# EAGLE design bpf+att (EAGLE 9.6.2)
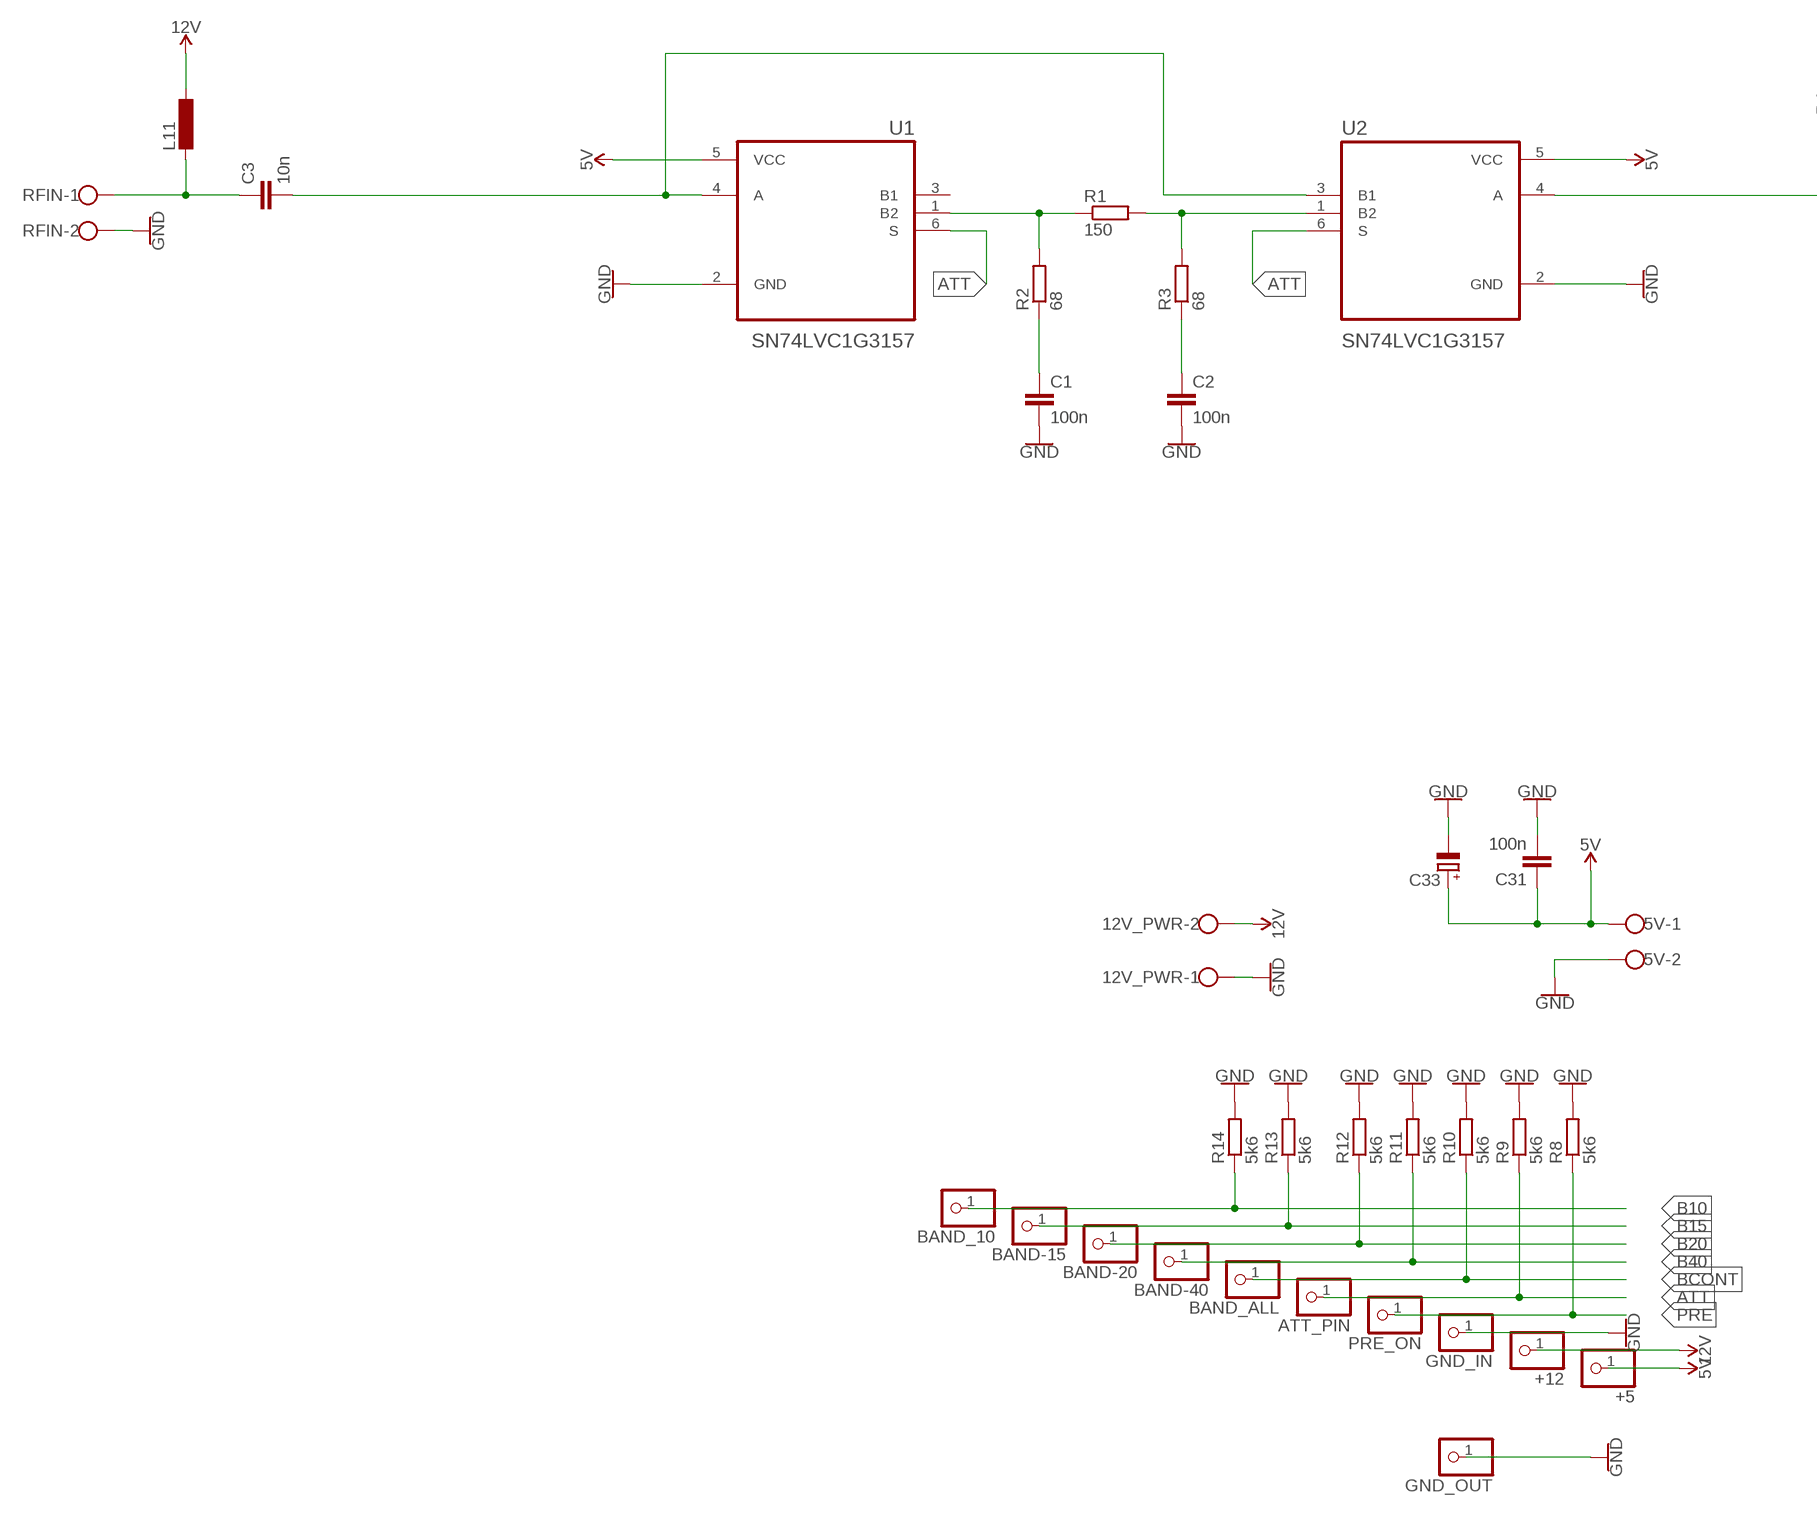
[diagram p0: schematic, sheet 1, part 1 of 2]
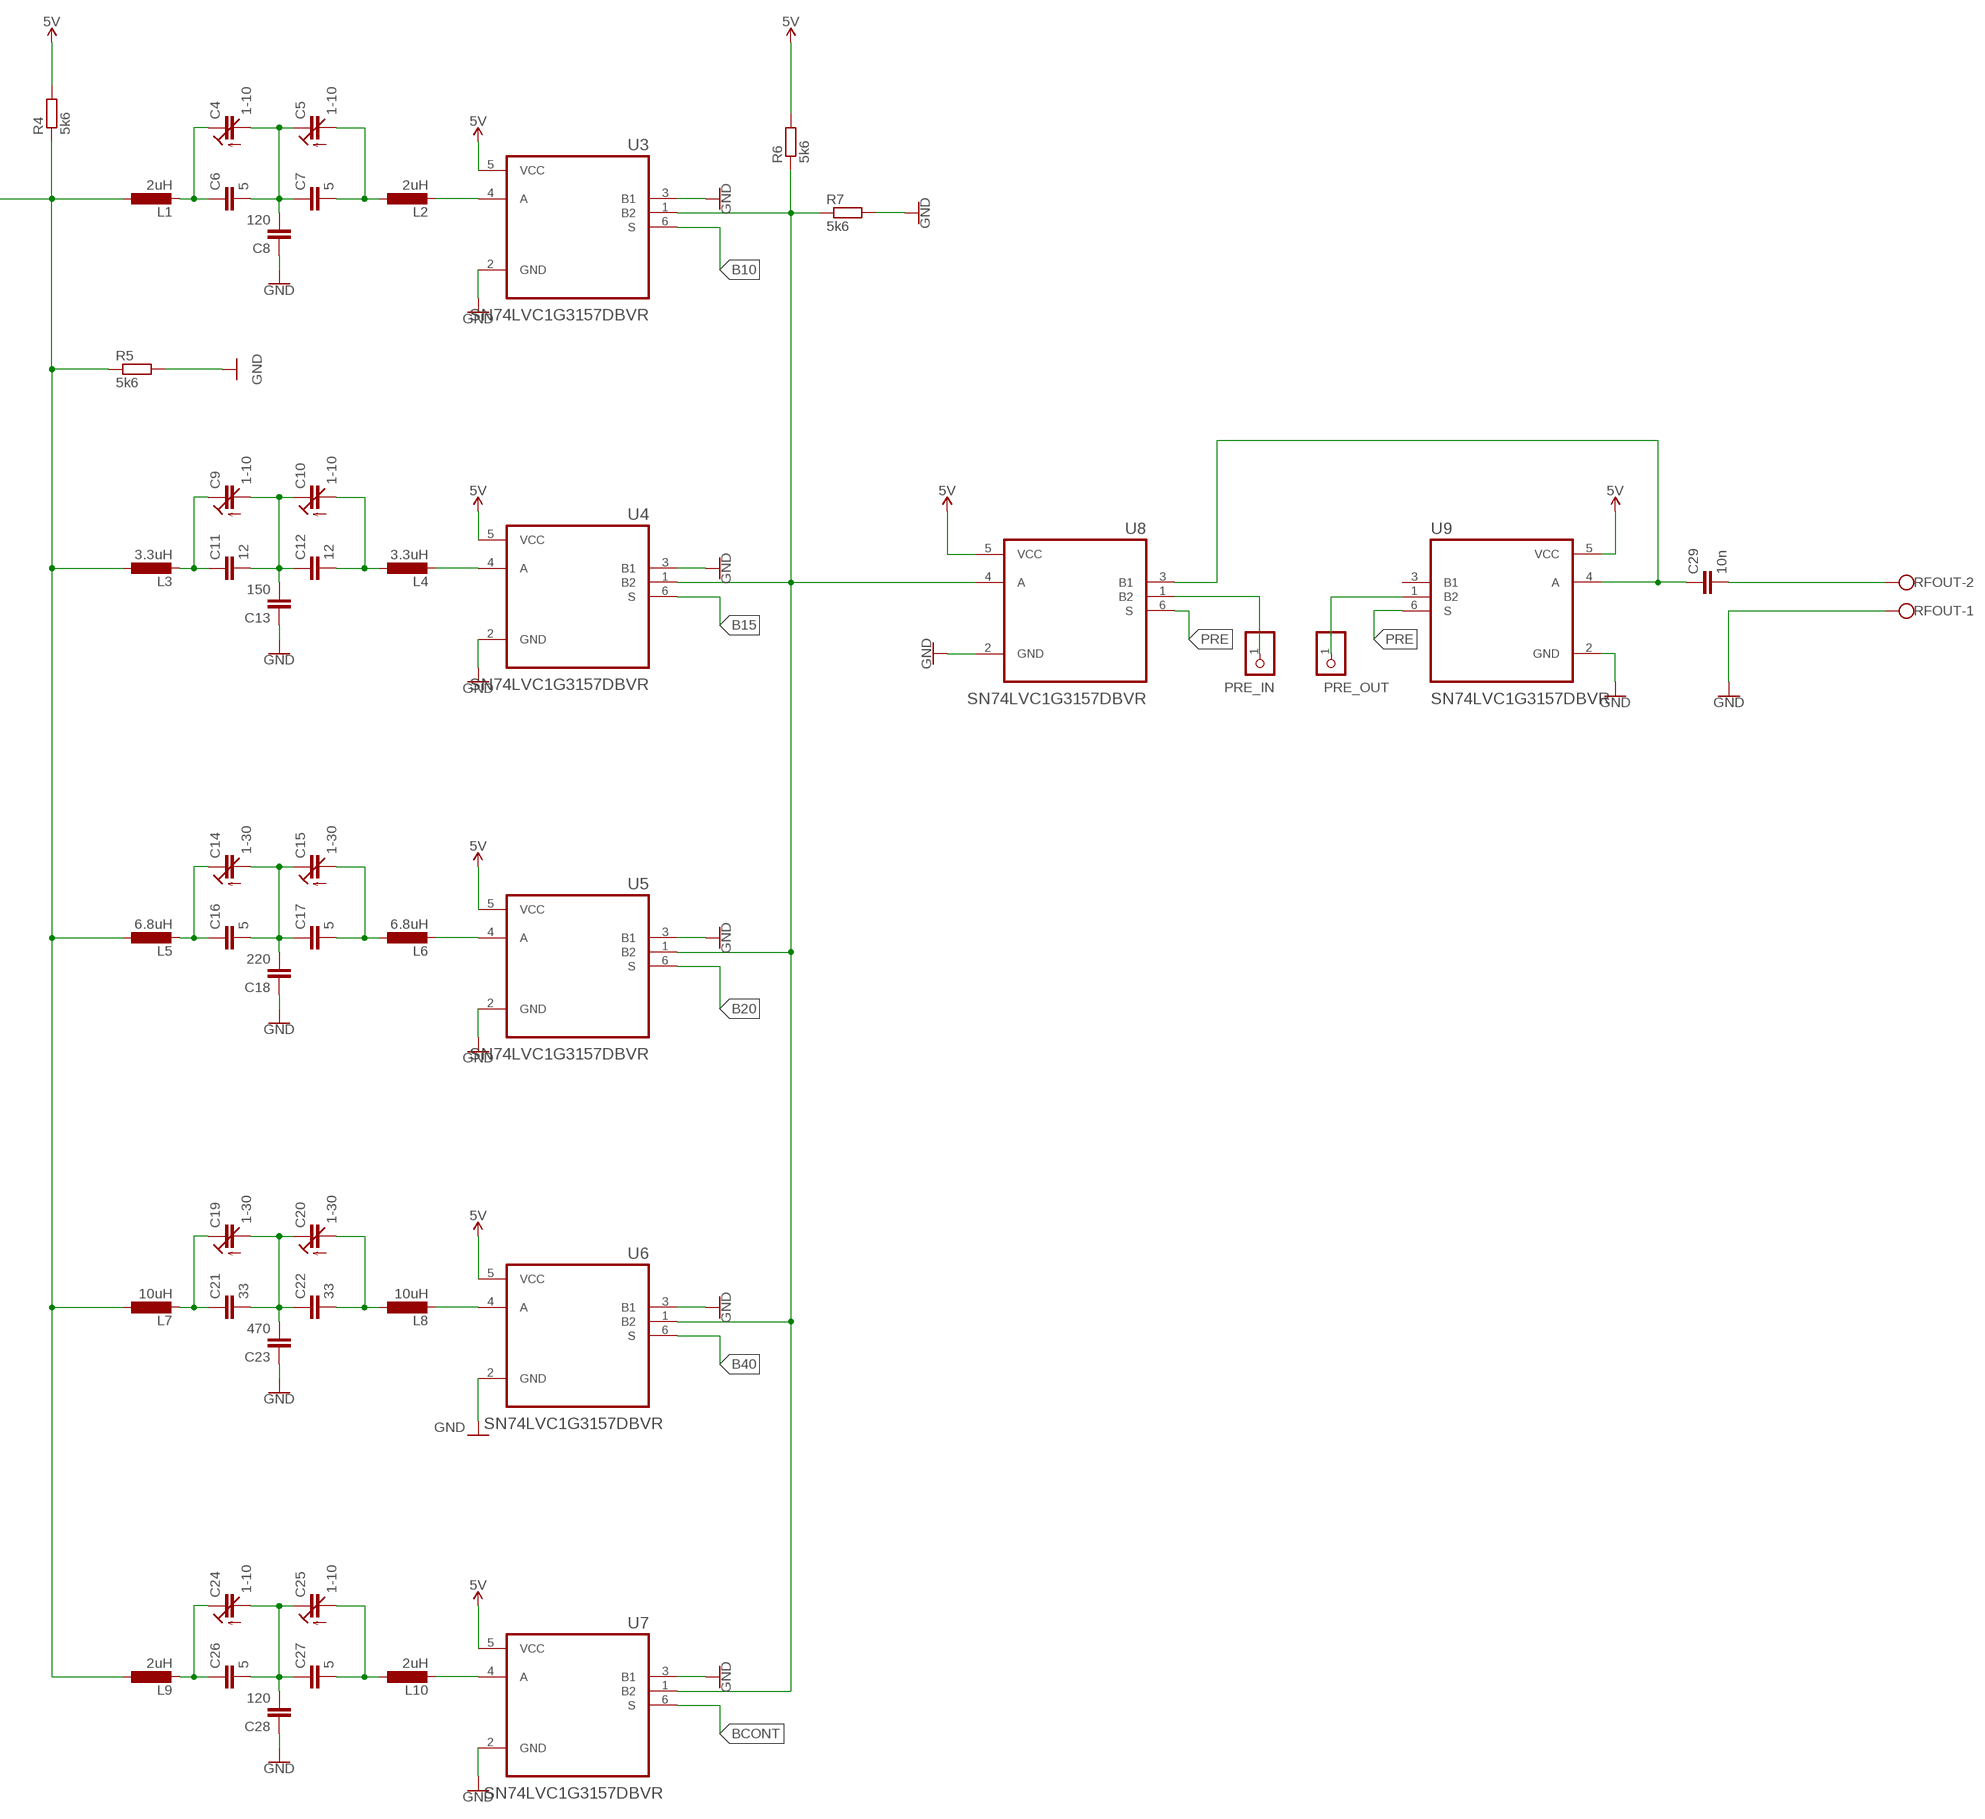
[diagram p1: schematic, sheet 1, part 2 of 2]

## Parts
5V  W237-102  [W237-102]
12V_PWR  W237-102  [W237-102]
+5  PINHD-1X1  [1X01]
+12  PINHD-1X1  [1X01]
ATT_PIN  PINHD-1X1  [1X01]
BAND-15  PINHD-1X1  [1X01]
BAND-20  PINHD-1X1  [1X01]
BAND-40  PINHD-1X1  [1X01]
BAND_10  PINHD-1X1  [1X01]
BAND_ALL  PINHD-1X1  [1X01]
C1  100n  C-EUC1206  [C1206]
C2  100n  C-EUC1206  [C1206]
C3  10n  C-EUC1206K  [C1206K]
C4  1-10  C-TRIMM3050.504  [CTRIM3050.504]
C5  1-10  C-TRIMM3050.504  [CTRIM3050.504]
C6  5  C-EUC1206K  [C1206K]
C7  5  C-EUC1206K  [C1206K]
C8  120  C-EUC1206K  [C1206K]
C9  1-10  C-TRIMM3050.504  [CTRIM3050.504]
C10  1-10  C-TRIMM3050.504  [CTRIM3050.504]
C11  12  C-EUC1206K  [C1206K]
C12  12  C-EUC1206K  [C1206K]
C13  150  C-EUC1206K  [C1206K]
C14  1-30  C-TRIMM3050.504  [CTRIM3050.504]
C15  1-30  C-TRIMM3050.504  [CTRIM3050.504]
C16  5  C-EUC1206K  [C1206K]
C17  5  C-EUC1206K  [C1206K]
C18  220  C-EUC1206K  [C1206K]
C19  1-30  C-TRIMM3050.504  [CTRIM3050.504]
C20  1-30  C-TRIMM3050.504  [CTRIM3050.504]
C21  33  C-EUC1206K  [C1206K]
C22  33  C-EUC1206K  [C1206K]
C23  470  C-EUC1206K  [C1206K]
C24  1-10  C-TRIMM3050.504  [CTRIM3050.504]
C25  1-10  C-TRIMM3050.504  [CTRIM3050.504]
C26  5  C-EUC1206K  [C1206K]
C27  5  C-EUC1206K  [C1206K]
C28  120  C-EUC1206K  [C1206K]
C29  10n  C-EUC1206K  [C1206K]
C31  100n  C-EUC1206  [C1206]
C33  CPOL-EUSMCD  [SMC_D]
GND_IN  PINHD-1X1  [1X01]
GND_OUT  PINHD-1X1  [1X01]
L1  2uH  L-EU0204/7  [0204/7]
L2  2uH  L-EU0204/7  [0204/7]
L3  3.3uH  L-EU0204/7  [0204/7]
L4  3.3uH  L-EU0204/7  [0204/7]
L5  6.8uH  L-EU0204/7  [0204/7]
L6  6.8uH  L-EU0204/7  [0204/7]
L7  10uH  L-EU0204/7  [0204/7]
L8  10uH  L-EU0204/7  [0204/7]
L9  2uH  L-EU0204/7  [0204/7]
L10  2uH  L-EU0204/7  [0204/7]
L11  L-EU0204/7  [0204/7]
PRE_IN  PINHD-1X1  [1X01]
PRE_ON  PINHD-1X1  [1X01]
PRE_OUT  PINHD-1X1  [1X01]
R1  150  R-EU_R1206  [R1206]
R2  68  R-EU_R1206  [R1206]
R3  68  R-EU_R1206  [R1206]
R4  5k6  R-EU_R1206  [R1206]
R5  5k6  R-EU_R1206  [R1206]
R6  5k6  R-EU_R0805  [R0805]
R7  5k6  R-EU_R0805  [R0805]
R8  5k6  R-EU_R1206  [R1206]
R9  5k6  R-EU_R1206  [R1206]
R10  5k6  R-EU_R0805  [R0805]
R11  5k6  R-EU_R0805  [R0805]
R12  5k6  R-EU_R0805  [R0805]
R13  5k6  R-EU_R0805  [R0805]
R14  5k6  R-EU_R0805  [R0805]
RFIN  W237-102  [W237-102]
RFOUT  W237-102  [W237-102]
U1  SN74LVC1G3157  SN74LVC1G3157DBVR  [SOT95P280X145-6N]
U2  SN74LVC1G3157  SN74LVC1G3157DBVR  [SOT95P280X145-6N]
U3  SN74LVC1G3157DBVR  [SOT95P280X145-6N]
U4  SN74LVC1G3157DBVR  [SOT95P280X145-6N]
U5  SN74LVC1G3157DBVR  [SOT95P280X145-6N]
U6  SN74LVC1G3157DBVR  [SOT95P280X145-6N]
U7  SN74LVC1G3157DBVR  [SOT95P280X145-6N]
U8  SN74LVC1G3157DBVR  [SOT95P280X145-6N]
U9  SN74LVC1G3157DBVR  [SOT95P280X145-6N]

## Nets
5V: 5V.1 +5.1 C31.1 C33.+ R4.2 R6.2 U1.5(VCC) U2.5(VCC) U3.5(VCC) U4.5(VCC) U5.5(VCC) U6.5(VCC) U7.5(VCC) U8.5(VCC) U9.5(VCC)
12V: 12V_PWR.2 +12.1 L11.1
ATT: ATT_PIN.1 R9.1 U1.6(S) U2.6(S)
B10: BAND_10.1 R14.1 U3.6(S)
B15: BAND-15.1 R13.1 U4.6(S)
B20: BAND-20.1 R12.1 U5.6(S)
B40: BAND-40.1 R11.1 U6.6(S)
BCONT: BAND_ALL.1 R10.1 U7.6(S)
BYPASS: R6.1 R7.1 U3.1(B2) U4.1(B2) U5.1(B2) U6.1(B2) U7.1(B2) U8.4(A)
FILTER_INPUT: L1.1 L3.1 L5.1 L7.1 L9.1 R4.1 R5.1 U2.4(A)
GND: 5V.2 12V_PWR.1 C1.2 C2.2 C8.1 C13.1 C18.1 C23.1 C28.1 C31.2 C33.- GND_IN.1 GND_OUT.1 R5.2 R7.2 R8.2 R9.2 R10.2 R11.2 R12.2 R13.2 R14.2 RFIN.2 RFOUT.1 U1.2(GND) U2.2(GND) U3.2(GND) U3.3(B1) U4.2(GND) U4.3(B1) U5.2(GND) U5.3(B1) U6.2(GND) U6.3(B1) U7.2(GND) U7.3(B1) U8.2(GND) U9.2(GND)
N$1: R1.1 R2.2 U1.1(B2)
N$2: R1.2 R3.2 U2.1(B2)
N$3: C1.1 R2.1
N$4: C2.1 R3.1
N$5: C3.2 U1.4(A) U2.3(B1)
N$6: C3.1 L11.2 RFIN.1
N$8: C4.1(E) C6.1 L1.2
N$9: C4.2(A) C5.1(E) C6.2 C7.1 C8.2
N$10: C5.2(A) C7.2 L2.1
N$11: L2.2 U3.4(A)
N$13: C29.1 U8.3(B1) U9.4(A)
N$14: C9.1(E) C11.1 L3.2
N$15: C9.2(A) C10.1(E) C11.2 C12.1 C13.2
N$16: C10.2(A) C12.2 L4.1
N$17: L4.2 U4.4(A)
N$18: C29.2 RFOUT.2
N$19: PRE_IN.1 U8.1(B2)
N$20: C14.1(E) C16.1 L5.2
N$21: C14.2(A) C15.1(E) C16.2 C17.1 C18.2
N$22: C15.2(A) C17.2 L6.1
N$23: L6.2 U5.4(A)
N$24: PRE_OUT.1 U9.1(B2)
N$26: C19.1(E) C21.1 L7.2
N$27: C19.2(A) C20.1(E) C21.2 C22.1 C23.2
N$28: C20.2(A) C22.2 L8.1
N$29: L8.2 U6.4(A)
N$32: C24.1(E) C26.1 L9.2
N$33: C24.2(A) C25.1(E) C26.2 C27.1 C28.2
N$34: C25.2(A) C27.2 L10.1
N$35: L10.2 U7.4(A)
PRE: PRE_ON.1 R8.1 U8.6(S) U9.6(S)
Unconnected: U1.3(B1) U9.3(B1)

## Library data of the parts
5V 12V_PWR RFIN RFOUT = con-wago-500:W237-102: WAGO SCREW CLAMP; MPN: 237-102; OC_FARNELL: unknown; OC_NEWARK: 70K9898
+5 +12 ATT_PIN BAND-15 BAND-20 BAND-40 BAND_10 BAND_ALL GND_IN GND_OUT PRE_IN PRE_ON PRE_OUT = adafruit:PINHD-1X1: Pin header 1x1 for 0.1" spacing With round pins
C1-C3 C6-C8 C11-C13 C16-C18 C21-C23 C26-C29 C31 = rcl:C-EU: CAPACITOR, European symbol; SPICEPREFIX: C
C4 C5 C9 C10 C14 C15 C19 C20 C24 C25 = rcl:C-TRIMM: Trimm capacitor; SPICEPREFIX: C
C33 = rcl:CPOL-EU: POLARIZED CAPACITOR, European symbol; SPICEPREFIX: C
L1-L11 = rcl_home_optimized:L-EU: INDUCTOR, European symbol; SPICEPREFIX: L
R1-R14 = rcl:R-EU_: RESISTOR, European symbol; SPICEPREFIX: R
U1-U9 = SN74LVC1G3157DBVR:SN74LVC1G3157DBVR: Check prices <https://pricing.snapeda.com/parts/SN74LVC1G3157DBVR/Texas%20Instruments/view-part?ref=eda>; AVAILABILITY: In Stock; DESCRIPTION: 5-V, 2:1 (SPDT), 1-channel general-purpose analog switch 6-SOT-23 -40 to 125; MF: Texas Instruments; MP: SN74LVC1G3157DBVR; PACKAGE: SOT-23-6 Texas Instruments; PRICE: None; PURCHASE-URL: https://pricing.snapeda.com/search/part/SN74LVC1G3157DBVR/?ref=eda

## Board
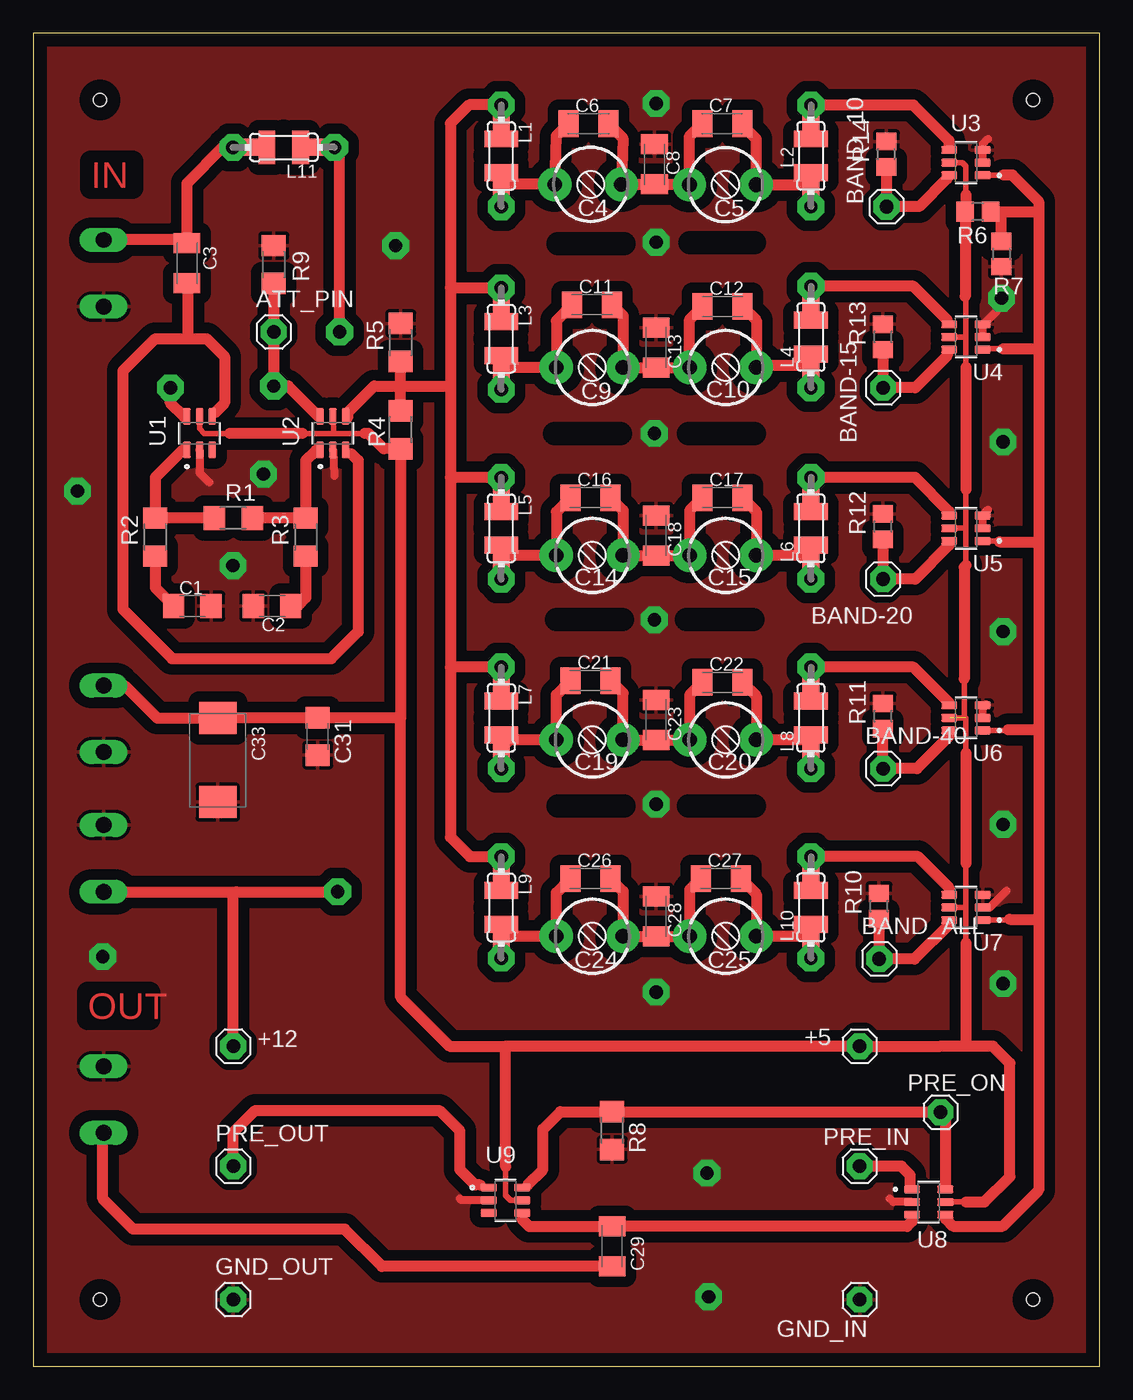
[diagram p2: board, top side]
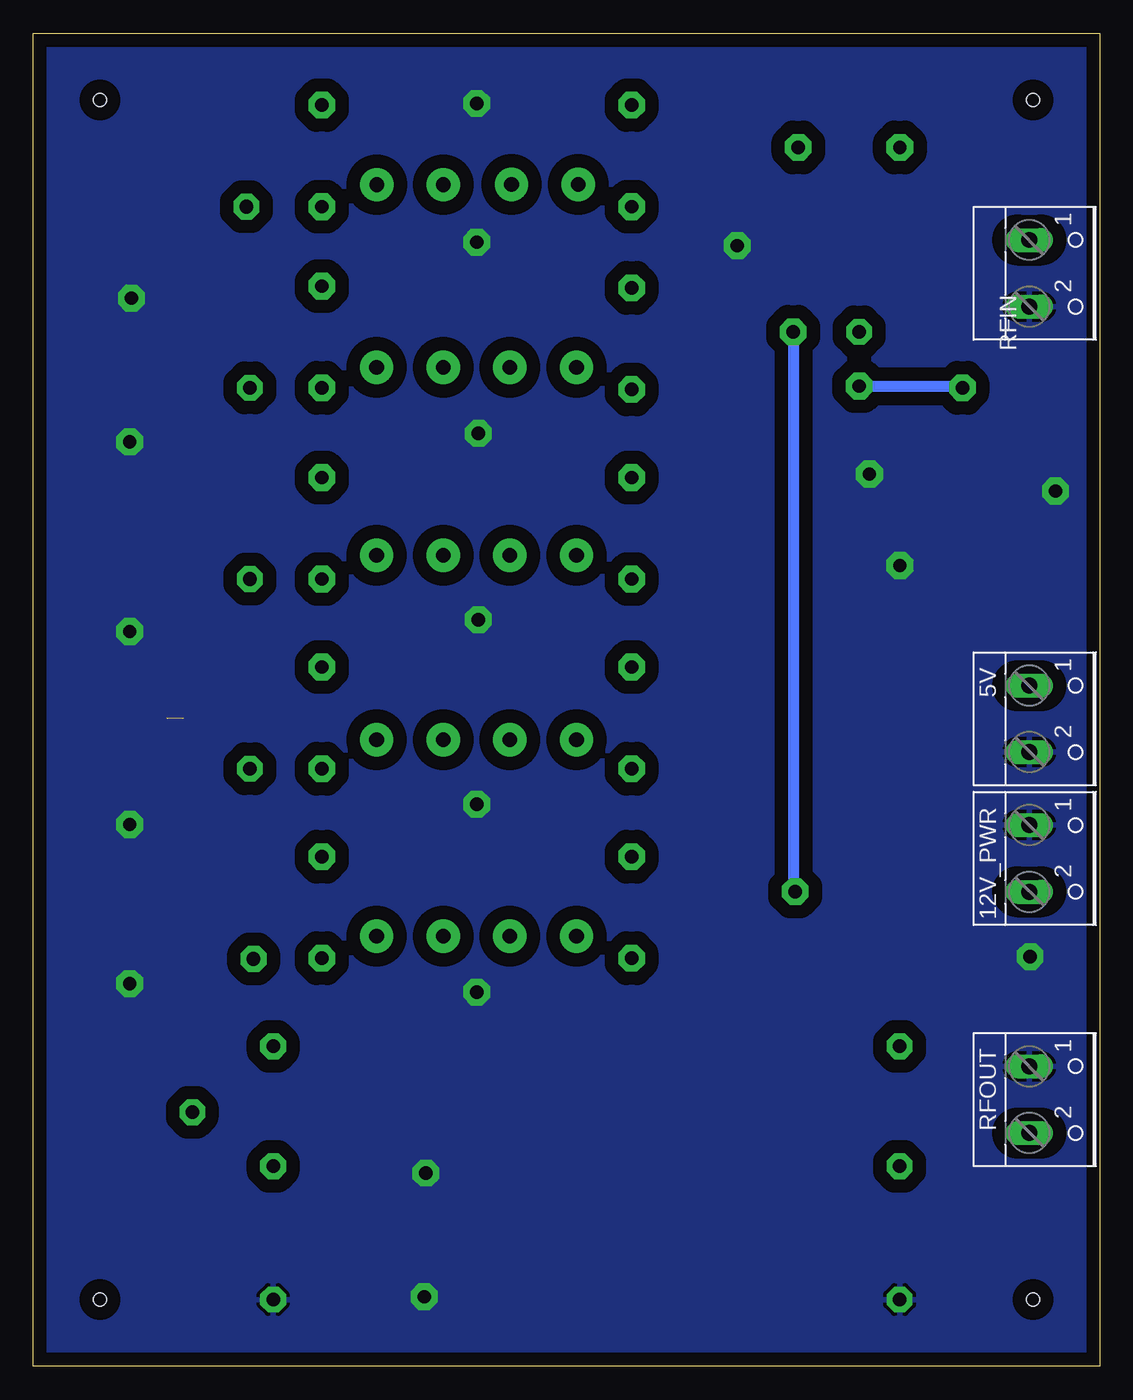
[diagram p3: board, bottom side, seen from below]

Size 80 x 100 mm. Coordinates in mm from the lower left corner, seen from the top.
Outline: 0,0 80,0 80,100 0,100 0,0
Copper layers (1*16): Top 0.035mm / dielectric 1.5mm / Bottom 0.035mm
Design rules "default": minimum track width 6mil, minimum drill 0.35mm, track to track 6mil, track to pad 6mil, pad to pad 6mil, via to via 6mil, smd to smd 6mil, copper to edge 40mil, drill to drill 6mil, minimum pad ring 10mil, minimum via ring 8mil, stop-mask expansion 4mil, vias tented up to drill 0mil, thermal gap 10mil
Holes 1 mm at 5,5 75,95 5,95 75,5
tRestrict: 8 lines

### Footprints (pad centres in the part's own frame; a part is rotated, then mirrored left to right if it is on the bottom)
W237-102 = drill 1.194 long: 1 -2.5,-1.27; 2 2.5,-1.27
1X01 = drill 1.016 pad 1.93 octagon: 1 0,0
C1206 = smd 1.6 x 1.8: 1 -1.4,0; 2 1.4,0
C1206K = smd 1.5 x 2: 1 -1.5,0; 2 1.5,0
CTRIM3050.504 = drill 1.1 pad 2.5: 1 -2.5,0; 2 2.5,0
SMC_D = smd 2.4 x 2.8: + -3.15,0; - 3.15,0
0204/7 = drill 1 pad 2 octagon: 1 -3.81,0; 2 3.81,0 | smd 1.27 x 2.54: P$1 -1.27,0; P$2 1.27,0 | smd 1.27 x 1.27: P$3 -2.54,0; P$4 2.54,0
R1206 = smd 1.6 x 1.803: 1 -1.422,0; 2 1.422,0
R0805 = smd 1.3 x 1.5: 1 -0.95,0; 2 0.95,0
SOT95P280X145-6N = smd 1.21 x 0.58: 1 -1.255,0.95; 2 -1.255,0; 3 -1.255,-0.95; 4 1.255,-0.95; 5 1.255,0; 6 1.255,0.95

### Placement (x,y rotation side)
5V  4,48.57 270 bottom
12V_PWR  4,38.09 270 bottom
+5  62,24 0 top
+12  15,24 0 top
ATT_PIN  18.03,77.6 0 top
BAND-15  63.75,73.41 0 top
BAND-20  63.75,59.05 0 top
BAND-40  63.75,44.83 0 top
BAND_10  64.01,87 0 top
BAND_ALL  63.47,30.56 0 top
C1  11.94,57.02 0 top
C2  17.91,57.02 180 top
C3  11.53,82.75 270 top
C4  41.62,88.67 0 top
C5  51.73,88.65 0 top
C6  41.66,93.22 0 top
C7  51.69,93.22 0 top
C8  46.61,90.17 270 top
C9  41.75,74.93 0 top
C10  51.75,74.93 0 top
C11  41.93,79.63 0 top
C12  51.71,79.5 0 top
C13  46.74,76.43 270 top
C14  41.75,60.83 0 top
C15  51.75,60.83 0 top
C16  41.81,65.15 0 top
C17  51.71,65.15 0 top
C18  46.74,62.33 270 top
C19  41.75,46.99 0 top
C20  51.75,46.99 0 top
C21  41.81,51.44 0 top
C22  51.71,51.31 0 top
C23  46.74,48.49 270 top
C24  41.75,32.26 0 top
C25  51.75,32.26 0 top
C26  41.81,36.58 0 top
C27  51.59,36.58 0 top
C28  46.74,33.76 270 top
C29  43.43,8.99 270 top
C31  21.34,47.24 270 top
C33  13.84,45.47 270 top
GND_IN  62,5 0 top
GND_OUT  15,5 0 top
L1  35.11,90.81 270 top
L2  58.35,90.81 90 top
L3  35.11,77.09 270 top
L4  58.35,77.22 90 top
L5  35.11,62.87 270 top
L6  58.35,62.87 90 top
L7  35.11,48.64 270 top
L8  58.35,48.64 90 top
L9  35.11,34.42 270 top
L10  58.35,34.42 90 top
L11  18.8,91.44 180 top
PRE_IN  62,15 0 top
PRE_ON  68.07,19.05 0 top
PRE_OUT  15,15 0 top
R1  15.01,63.63 0 top
R2  9.14,62.2 90 top
R3  20.45,62.2 90 top
R4  27.56,70.26 270 top
R5  27.56,76.81 90 top
R6  70.87,86.61 180 top
R7  72.64,83.44 270 top
R8  43.43,17.68 270 top
R9  18.03,82.65 90 top
R10  63.45,34.52 90 top
R11  63.75,48.77 90 top
R12  63.75,62.99 90 top
R13  63.75,77.22 90 top
R14  64.01,90.93 90 top
RFIN  4,82 270 bottom
RFOUT  4,20 270 bottom
U1  12.48,70 90 top
U2  22.48,70 90 top
U3  69.98,90.3 180 top
U4  69.98,77.22 180 top
U5  69.98,62.87 180 top
U6  69.98,48.64 180 top
U7  69.98,34.42 180 top
U8  67.18,12.32 0 top
U9  35.43,12.45 0 top

### Tracks (layer width: path | path; a pad name or v marks a point on that pad's centre or on a via)
5V  (1 unrouted)
  Top 0.406: U3.5 69.72,90.3 69.98,90.04 69.98,87.88 | 69.98,74.93 69.98,77.22 | U4.5 69.98,77.22 | 69.98,60.07 69.98,62.87 | 69.98,65.79 69.98,62.87 | 69.85,51.56 69.85,48.64 U6.5 | 69.98,45.97 69.98,48.64 | 69.98,37.72 69.98,34.42 | U7.5 69.98,34.42 | U5.5 69.98,62.87 | U9.5 35.81,12.45 35.43,12.83 35.43,14.99 | 24.89,69.98 22.54,69.98 | U2.5 22.54,69.98 | 69.98,34.42 69.98,31.75 | U8.5 69.98,12.32 | 20.19,69.98 22.54,69.98 | 69.92,80.25 69.98,80.19 69.98,77.22 | 14.73,69.98 12.83,69.98 12.48,70.33 U1.5
  Top 0.813: 69.98,87.88 69.98,86.67 R6.2 | R6.2 69.85,86.55 | 69.98,74.93 69.98,65.79 | 69.98,60.07 69.85,59.94 69.85,51.56 | 69.98,45.97 69.98,37.72 | 27.56,48.64 27.56,27.69 31.24,24 35.43,24 | C33.+ 13.78,48.56 | C33.+ 21.31,48.62 C31.1 27.56,48.64 | 69.98,31.75 69.98,24 | 20.19,69.98 14.73,69.98 | 69.98,24 72.01,24 73.28,22.73 73.28,14.22 71.37,12.32 69.98,12.32 | 69.98,24 68.07,24 +5.1 35.43,24 | 35.43,14.99 35.43,24 | R6.2 69.92,80.25 | 5V.1 6.84,51.07 9.3,48.62 C33.+ | 24.89,69.98 25.15,69.98 26.29,68.83 R4.2 27.56,48.64
12V  (via drill 1 pad 2)
  Top 0.813: v22.99,77.6 22.99,91.44 L11.1 | 22.8,35.58 v22.84,35.61 22.82,35.59 15.24,35.59 | 12V_PWR.2 15.24,35.59 | +12.1 15,35.35 15.24,35.59
  Bottom 0.813: v22.99,77.6 22.99,35.76 v22.84,35.61
ATT  (via drill 1 pad 2)
  Top 0.406: U1.6 11.36,71.25 11.32,71.23 | U2.6 21.4,71.25
  Top 0.813: R9.1 ATT_PIN.1 v18.03,73.53 19.12,73.53 21.4,71.25 | 11.32,71.23 10.29,72.26 v10.29,73.41
  Bottom 0.813: v18.03,73.53 10.41,73.53 v10.29,73.41
B10
  Top 0.406: 64.14,89.35 64.01,89.47 R14.1 | U3.6 68.72,89.25 68.56,89.08
  Top 0.813: R14.1 BAND_10.1 66.47,87 68.56,89.08
B15
  Top 0.406: 68.58,75.95 68.58,76.12 U4.6
  Top 0.813: 63.82,76.2 R13.1 BAND-15.1 66.17,73.41 68.58,75.82 68.58,75.95
B20
  Top 0.406: U5.6 68.72,61.61 68.71,61.59
  Top 0.813: 63.77,62.03 R12.1 BAND-20.1 66.17,59.05 68.71,61.59
B40
  Top 0.406: U6.6 68.71,47.68 68.71,47.37
  Top 0.813: R11.1 63.88,47.69 63.75,47.56 BAND-40.1 66.29,44.83 68.71,47.24 68.71,47.37
BCONT
  Top 0.406: 68.45,33.47 U7.6 68.72,33.26 68.56,33.1
  Top 0.813: R10.1 63.48,33.54 BAND_ALL.1 66.12,30.56 68.72,33.16 68.72,33.26
BYPASS
  Top 0.406: 72.8,89.36 71.24,89.36 U3.1 | 68.69,11.37 U8.4 68.45,11.35 68.45,11.05 | U4.1 71.29,76.33 72.77,76.33 | U5.1 72.58,61.91 72.52,61.85 | U6.1 73.09,47.69 73.15,47.75 | 73.26,33.53 73.26,33.47 U7.1
  Top 0.813: 75.44,61.85 75.44,47.75 | 75.44,47.75 75.44,33.53 | 75.44,33.53 75.44,13.21 72.73,10.5 69,10.5 68.45,11.05 | 72.8,89.36 73.46,89.36 75.44,87.38 75.44,86.61 | 75.44,86.61 75.44,76.33 | 75.44,76.33 75.44,61.85 | 72.77,76.33 75.44,76.33 | 72.52,61.85 75.44,61.85 | 73.15,47.75 75.44,47.75 | 73.26,33.53 75.44,33.53 | R6.1 72.64,86.61 | 72.64,86.61 75.44,86.61 | R7.1 72.64,86.61
FILTER_INPUT
  Top 0.406: U2.4 23.5,71.08 23.57,71.14
  Top 0.813: 31.3,80.9 31.3,73.53 | 31.3,73.53 31.3,66.67 | 31.3,66.67 31.3,52.45 | 31.3,52.45 31.3,39.69 32.77,38.23 L9.1 | L7.1 31.3,52.45 | L5.1 31.3,66.67 | L3.1 31.3,80.9 | 23.57,71.14 23.57,71.53 25.58,73.53 27.56,73.53 | 27.56,73.53 31.3,73.53 | L1.1 35.09,94.64 32.7,94.64 31.3,93.25 31.3,80.9 | R4.1 27.56,73.53 | 27.56,73.53 R5.1
GND  (via drill 1 pad 2)
  Top 0.61: U9.2 32.13,12.45 32,12.57 | U8.2 64.52,12.32 64.26,12.57 | U7.2 71.75,34.42 73.03,35.69 | U6.2 71.23,49.39 71.5,49.66 | U5.2 71.23,63.87 71.63,64.26 | 72.26,79.12 71.23,78.09 U4.2 | U3.2 71.23,91.68 71.63,92.08 | U1.2 12.48,67.17 12.45,67.06 13.21,66.29 | U2.2 22.58,66.83 22.61,66.8
  other vias: 72.77,28.7 72.77,40.64 72.77,55.12 72.77,69.34 72.64,80.14 3.3,65.66 14.99,60.07 17.27,66.93 46.61,69.98 46.61,56.01 46.74,42.16 50.55,14.48 46.74,28.07 46.74,84.33 5.21,30.73 46.74,94.74 27.18,84.07 50.67,5.21
  pour Top (isolate 0.813): -1.4,102.11 -1.4,-2.54 81.79,-2.54 81.79,102.11
  pour Bottom (isolate 1.016): 81.41,-2.03 -1.65,-2.03 -1.65,101.85 81.41,101.85
N$1
  Top 0.406: 11.18,68.71 11.18,68.75 U1.1
  Top 0.813: 11.18,68.71 9.14,66.67 R2.2 R1.1
N$2
  Top 0.406: U2.1 21.21,68.4 21.21,68.71
  Top 0.813: R1.2 R3.2 20.45,67.94 21.21,68.71
N$3
  Top 0.813: R2.1 9.14,58.41 C1.1
N$4
  Top 0.813: C2.1 19.82,57.02 20.45,57.65 R3.1
N$5
  Top 0.406: 13.4,71.23 U1.4 13.43,71.38 13.59,71.55 | 23.81,68.47 23.73,68.39 U2.3
  Top 0.813: 11.62,77.09 11.62,81.17 C3.2 | 23.81,68.47 23.86,68.47 24.38,67.94 24.38,55.12 22.35,53.09 10.41,53.09 6.73,56.77 6.73,74.68 9.14,77.09 11.62,77.09 | 11.62,77.09 13.02,77.09 14.35,75.75 14.35,72.27 13.59,71.51 13.59,71.55
N$6
  Top 0.813: RFIN.1 11.53,84.51 C3.1 11.53,88.75 14.22,91.44 L11.2
N$8
  Top 0.813: L1.2 35.11,88.67 C4.1 39.23,92.3 C6.1
N$9
  Top 0.813: C5.1 49.2,88.59 49.2,88.62 | C6.2 44.23,92.15 C4.2 C8.2 49.15,88.67 49.2,88.62 | C7.1 49.2,92.23 49.2,88.62
N$10
  Top 0.813: C7.2 53.19,93.09 54.16,92.12 54.23,92.08 C5.2 58.22,88.65 58.35,88.52 L2.1
N$11
  Top 0.406: U3.4 68.71,91.26 68.71,91.57
  Top 0.813: 68.71,91.57 68.71,91.95 66.04,94.61 L2.2
N$13
  Top 0.406: U9.4 36.69,10.99 | U8.3 65.93,10.86 | C29.1 43.45,10.48
  Top 0.813: 65.93,10.86 65.55,10.48 43.45,10.48 37.2,10.48 36.69,10.99
N$14
  Top 0.813: L3.2 35.11,74.93 C9.1 39.25,78.44 C11.1
N$15
  Top 0.813: C11.2 44.25,78.82 C9.2 C13.2 C10.1 49.25,78.53 C12.1
N$16
  Top 0.813: L4.1 58.35,75.06 54.37,75.06 C10.2 54.25,78.47 C12.2
N$17
  Top 0.406: U4.4 68.58,78.31 68.58,78.49
  Top 0.813: L4.2 66.04,81.03 68.58,78.49
N$18
  Top 0.813: C29.2 26.16,7.49 23.37,10.29 7.49,10.29 5.21,12.57 5.21,17.44 RFOUT.2
N$19
  Top 0.406: U8.1 65.79,13.41 65.79,13.59
  Top 0.813: 65.79,13.59 65.79,14.35 65.14,15 PRE_IN.1
N$20
  Top 0.813: L5.2 35.11,60.71 35.24,60.83 C14.1 39.25,64.09 C16.1
N$21
  Top 0.813: C16.2 44.25,64.21 C14.2 C18.2 C15.1 49.25,64.18 C17.1
N$22
  Top 0.813: L6.1 58.35,60.71 58.27,60.83 C15.2 54.25,64.12 C17.2
N$23
  Top 0.406: U5.4 68.71,63.83 68.71,64.14
  Top 0.813: 68.71,64.14 66.17,66.67 L6.2
N$24
  Top 0.406: U9.1 33.72,13.4 33.53,13.59
  Top 0.813: 33.53,13.59 33.15,13.59 32,14.73 32,17.65 30.47,19.19 16.65,19.19 15,17.54 PRE_OUT.1
N$26
  Top 0.813: L7.2 35.11,46.35 35.75,46.99 C19.1 39.25,50.37 C21.1
N$27
  Top 0.813: C21.2 44.25,50.5 C19.2 C23.2 C20.1 49.25,50.34 C22.1
N$28
  Top 0.813: L8.1 58.35,46.86 58.25,46.99 C20.2 54.25,50.27 C22.2
N$29
  Top 0.406: U6.4 68.72,49.77
  Top 0.813: 68.72,49.77 66.04,52.45 L8.2
N$32
  Top 0.813: L9.2 35.11,32.26 C24.1 39.25,35.52 C26.1
N$33
  Top 0.813: C26.2 44.25,35.64 C24.2 C28.2 C25.1 49.25,35.74 C27.1
N$34
  Top 0.813: L10.1 58.35,32.22 58.32,32.26 C25.2 54.25,35.42 C27.2
N$35
  Top 0.406: U7.4 68.72,35.88
  Top 0.813: L10.2 66.37,38.23 68.72,35.88
PRE
  Top 0.406: U8.6 68.44,13.57 68.45,13.59 | U9.6 36.88,13.59 37.08,13.59
  Top 0.813: 68.45,13.59 68.45,18.67 PRE_ON.1 68.02,19.1 R8.1 39.55,19.1 38.23,17.78 38.23,14.73 37.08,13.59

### Text on the board
Top: IN | OUT